# Altium schematic sheet lab4_schematic.SchDoc
size A4; Author: Michał Wojna; CompanyName: AGH; Revision: 1; SheetNumber: 1; SheetTotal: 3; SPICEModelCacheRHFFZEVK: <root> / <DocumentId>RHFFZEVK</DocumentId> / </root>
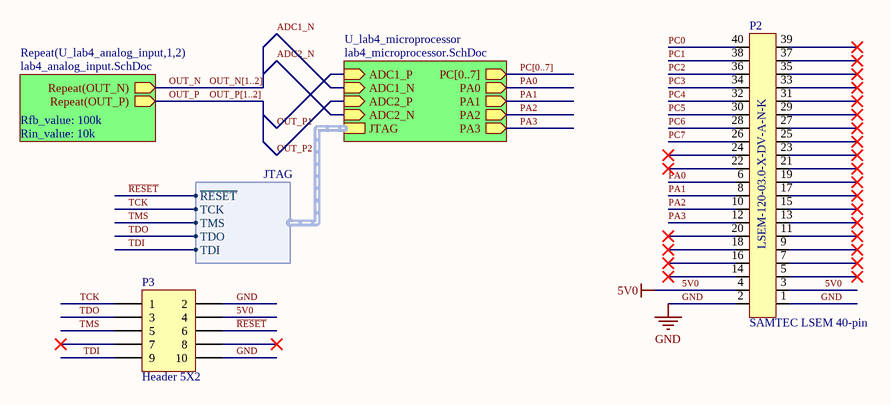
[diagram p0: lab4_schematic.SchDoc]

## Parts
P2  SAMTEC LSEM 40-pin  [LSEM-120-03.0-L-DV-A-N-K-TR]
P3  Header 5X2  [HDR2X5]

## Sub-sheets
Repeat(U_lab4_analog_input,1,2) = lab4_analog_input.SchDoc: Repeat(OUT_P) (out), Repeat(OUT_N) (out)  | Rfb_value: 100k; Rin_value: 10k
U_lab4_microprocessor = lab4_microprocessor.SchDoc: PC[0..7] (out), PA0 (out), PA1 (out), PA2 (out), PA3 (out), JTAG (harness JTAG), ADC2_P (in), ADC2_N (in), ADC1_N (in), ADC1_P (in)

## Harnesses
JTAG: ~{RESET}, TCK, TMS, TDO, TDI

## Nets
5V0: P2.3 P2.4 P3.4
GND: P2.1 P2.2 P3.2 P3.10
~{RESET}: P3.6 ; sheet U_lab4_microprocessor/JTAG.~{RESET}
ADC1_N: sheet U_lab4_microprocessor/ADC1_N
ADC2_N: sheet U_lab4_microprocessor/ADC2_N
OUT_N: sheet Repeat(U_lab4_analog_input,1,2)/Repeat(OUT_N)
OUT_P: sheet Repeat(U_lab4_analog_input,1,2)/Repeat(OUT_P)
OUT_P1: sheet U_lab4_microprocessor/ADC1_P
OUT_P2: sheet U_lab4_microprocessor/ADC2_P
PA0: P2.6 ; sheet U_lab4_microprocessor/PA0
PA1: P2.8 ; sheet U_lab4_microprocessor/PA1
PA2: P2.10 ; sheet U_lab4_microprocessor/PA2
PA3: P2.12 ; sheet U_lab4_microprocessor/PA3
PC0: P2.40
PC1: P2.38
PC2: P2.36
PC3: P2.34
PC4: P2.32
PC5: P2.30
PC6: P2.28
PC7: P2.26
TCK: P3.1 ; sheet U_lab4_microprocessor/JTAG.TCK
TDI: P3.9 ; sheet U_lab4_microprocessor/JTAG.TDI
TDO: P3.3 ; sheet U_lab4_microprocessor/JTAG.TDO
TMS: P3.5 ; sheet U_lab4_microprocessor/JTAG.TMS

Not connected (* = marked no-connect by the designer): P2 5(3)* 7(4)* 9(5)* 11(6)* 13(7)* 14(8)* 15(8)* 16(9)* 17(9)* 18(10)* 19(10)* 20(11)* 21(11)* 22(12)* 23(12)* 24(13)* 25(13)* 27(14)* 29(15)* 31(16)* 33(17)* 35(18)* 37(19)* 39(20)*; P3 7* 8*

## Buses and harness runs
bus OUT_N[1..2]
bus OUT_P[1..2]
bus PC[0..7] = sheet U_lab4_microprocessor/PC[0..7]

## Notes on the sheet
- Company Confidenrial / Not for distribution!
- Project name:
- Document Name:
- Designer Name:
- Date / Time:
- Revision:

## Library data of the parts
P2 = LSEM-120-03.0-X-DV-A-N-K: Manufacturer: SAMTEC; Part Number: LSEM-120-03.0-X-DV-A-N-K
P3 = Header 5X2: Header, 5-Pin, Dual row; LatestRevisionDate: 17-Jul-2002; LatestRevisionNote: Re-released for DXP Platform.; Publisher: Altium Limited